# EAGLE design untitled (EAGLE 9.6.2)
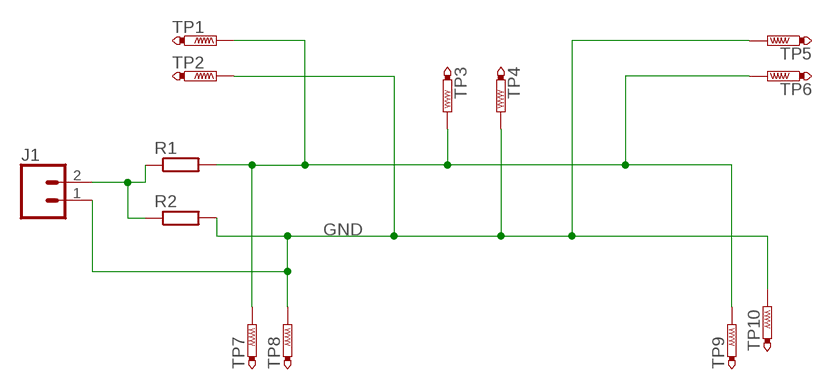
[diagram p0: schematic, sheet 1]

## Parts
J1  CONN_02LOCK_LONGPADS  [1X02_LOCK_LONGPADS]
R1  R-EU_0207/12  [0207/12]
R2  R-EU_0207/12  [0207/12]
TP1  PTR1TP20R  [TP20R]
TP2  PTR1TP20R  [TP20R]
TP3  PTR1TP20R  [TP20R]
TP4  PTR1TP20R  [TP20R]
TP5  PTR1TP20R  [TP20R]
TP6  PTR1TP20R  [TP20R]
TP7  PTR1TP20R  [TP20R]
TP8  PTR1TP20R  [TP20R]
TP9  PTR1TP20R  [TP20R]
TP10  PTR1TP20R  [TP20R]

## Nets
GND: J1.1 R2.2 TP2.TP TP4.TP TP5.TP TP8.TP TP10.TP
N$1: J1.2 R1.1 R2.1
VCC: R1.2 TP1.TP TP3.TP TP6.TP TP7.TP TP9.TP

## Library data of the parts
J1 = SparkFun-Connectors:CONN_02: Multi connection point. Often used as Generic Header-pin footprint for 0.1 inch spaced/style header connections On any of the 0.1 inch spaced packages, you can populate with these: Break Away Headers - Straight <https://www.sparkfun.com/products/116> (PRT-00116) Break Away Male Headers - Right Angle <https://www.sparkfun.com/products/553> (PRT-00553) Female Headers <https://www.sparkfun.com/products/115> (PRT-00115) Break Away Headers - Machine Pin <https://www.sparkfun.com/products/117> (PRT-00117) Break Away Female Headers - Swiss Machine Pin <https://www.sparkfun.com/products/743> (PRT-00743) For SCREWTERMINALS and SPRING TERMINALS visit here: Screw Terimnals on SparkFun.com <https://www.sparkfun.com/search/results?term=Screw+Terminals> (5mm/3.5mm/2.54mm spacing) This device is also useful as a general connection point to wire up your design to another part of your project. Our various solder wires solder well into these plated through hole pads. Hook-Up Wire - Assortment (Stranded, 22 AWG) <https://www.sparkfun.com/products/11375> (PRT-11375) Hook-Up Wire - Assortment (Solid Core, 22 AWG) <https://www.sparkfun.com/products/11367> (PRT-11367) View the entire wire category on our website here <https://www.sparkfun.com/categories/141> Special notes: Molex polarized connector foot print use with: PRT-08233 with associated crimp pins and housings. 2.54_SCREWTERM for use with PRT-10571. 3.5mm Screw Terminal footprints for PRT-08084 5mm Screw Terminal footprints for use with PRT-08432
R1 R2 = rcl:R-EU_: RESISTOR, European symbol; SPICEPREFIX: R
TP1-TP10 = testpad:PTR1: TEST PIN

## Board
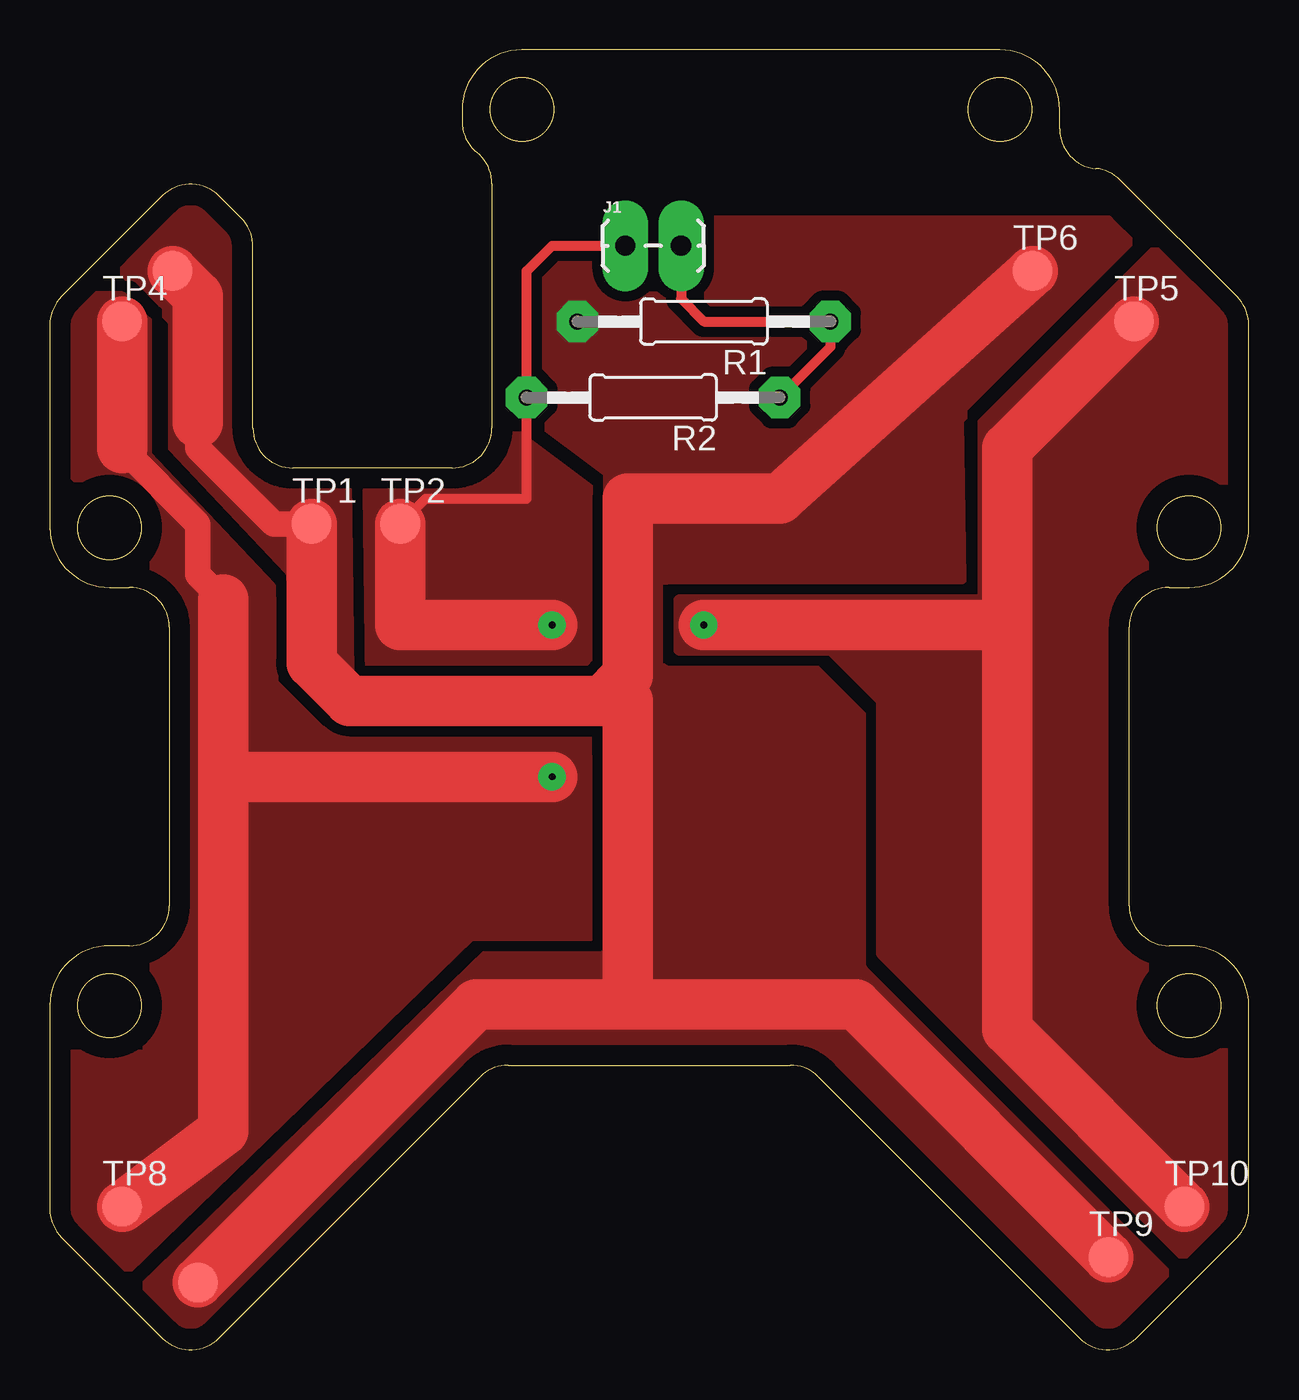
[diagram p1: board, top side]
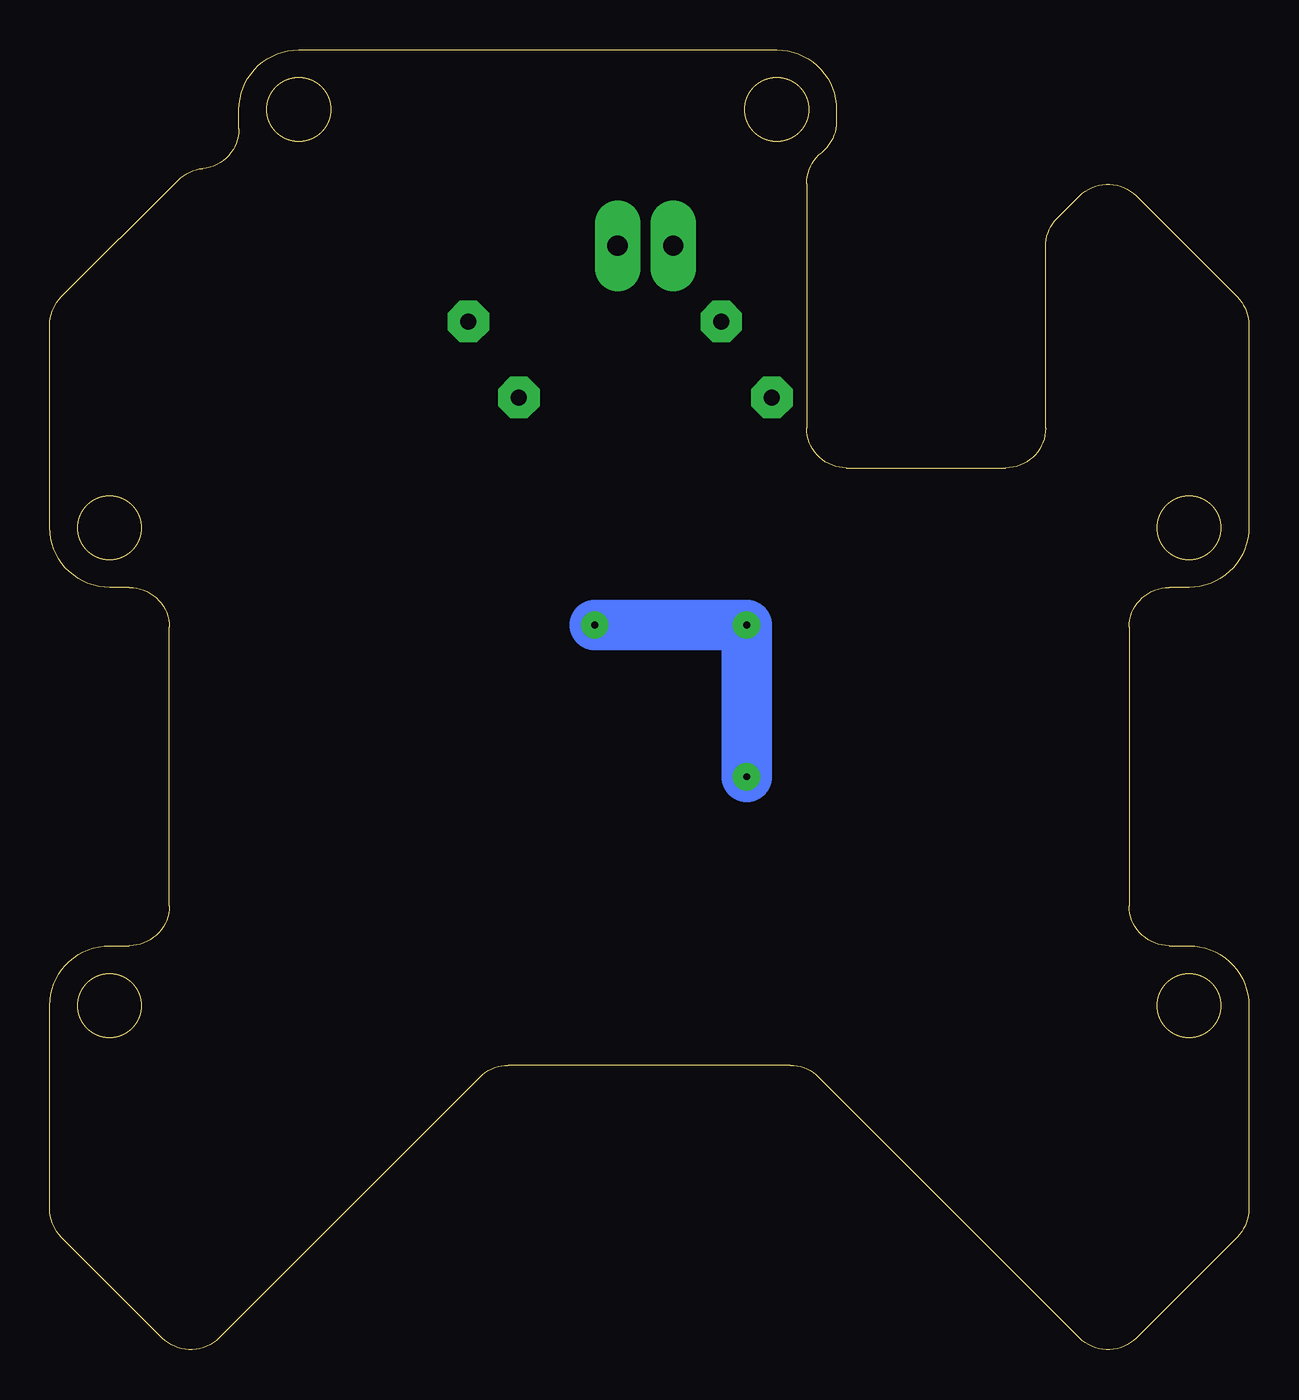
[diagram p2: board, bottom side, seen from below]

Size 60.2 x 65.29 mm. Coordinates in mm from the lower left corner, seen from the top.
Outline: 10.2,46.29 arc90 12.2,44.29 20.2,44.29 arc90 22.2,46.29 22.2,58.57 arc51 21.45,60.13 arc-51 20.7,61.69 20.7,62.29 arc-90 23.7,65.29 47.7,65.29 arc-90 50.7,62.29 50.7,61.32 arc85 52.51,59.33 arc-40 53.74,58.75 59.61,52.88 arc-45 60.2,51.47 60.2,41.29 arc-90 57.2,38.29 56.2,38.29 arc90 54.2,36.29 54.2,22.29 arc90 56.2,20.29 57.2,20.29 arc-90 60.2,17.29 60.2,7.07 arc-45 59.61,5.65 54.54,0.58 arc-90 51.71,0.58 38.59,13.71 arc45 37.18,14.29 23.02,14.29 arc45 21.61,13.71 8.49,0.58 arc-90 5.66,0.58 0.59,5.65 arc-45 0,7.07 0,17.29 arc-90 3,20.29 4,20.29 arc90 6,22.29 6,36.29 arc90 4,38.29 3,38.29 arc-90 0,41.29 0,51.47 arc-45 0.59,52.88 5.66,57.95 arc-90 8.49,57.95 9.61,56.83 arc-45 10.2,55.41 10.2,46.29
Outline: circle at 23.7,62.29 radius 1.6
Outline: circle at 57.2,17.29 radius 1.6
Outline: circle at 3,17.29 radius 1.6
Outline: circle at 3,41.29 radius 1.6
Outline: circle at 57.2,41.29 radius 1.6
Outline: circle at 47.7,62.29 radius 1.6
Copper layers (1*16): Top 0.035mm / dielectric 1.5mm / Bottom 0.035mm
Design rules "default *": minimum track width 6mil, minimum drill 0.9mm, track to track 12mil, track to pad 12mil, pad to pad 12mil, via to via 12mil, smd to smd 12mil, copper to edge 40mil, drill to drill 6mil, minimum pad ring 25mil, minimum via ring 20mil, stop-mask expansion 4mil, vias tented up to drill 0mil, thermal gap 10mil

### Footprints (pad centres in the part's own frame; a part is rotated, then mirrored left to right if it is on the bottom)
1X02_LOCK_LONGPADS = drill 1.016 long: 1 -0.127,0; 2 2.667,0
0207/12 = drill 0.813 octagon: 1 -6.35,0; 2 6.35,0
TP20R = smd 2 x 2: TP 0,0

### Placement (x,y rotation side)
J1  29.03,55.45 0 top
R1  32.84,51.64 180 top
R2  30.3,47.83 180 top
TP1  13.15,41.48 0 top
TP2  17.6,41.48 0 top
TP3  6.17,54.18 0 top
TP4  3.63,51.64 0 top
TP5  54.43,51.64 0 top
TP6  49.35,54.18 0 top
TP7  7.44,3.38 0 top
TP8  3.63,7.19 0 top
TP9  53.16,4.65 0 top
TP10  56.97,7.19 0 top

### Tracks (layer width: path | path; a pad name or v marks a point on that pad's centre or on a via)
GND  (via drill 0.35)
  Top 0.508: TP2.TP 18.87,42.75 23.95,42.75 R2.2 23.95,54.18 25.22,55.45 J1.1
  Top 1.27: 3.63,45.29 7.44,41.48 7.44,38.94 8.71,37.67
  Top 2.54: TP4.TP 3.63,45.29 | TP8.TP 8.71,11 8.71,28.78 | 8.71,28.78 8.71,37.67 | TP10.TP 48.08,16.08 48.08,36.4 | TP2.TP 17.6,36.4 v25.22,36.4 | TP5.TP 48.08,45.29 48.08,36.4 | v32.84,36.4 48.08,36.4 | v25.22,28.78 8.71,28.78
  Bottom 2.54: v32.84,36.4 v25.22,36.4 v25.22,28.78
  pour Top (isolate 0.508, no thermals): 0.83,6.55 2.99,3.13 21.15,20.78 27.12,20.78 26.99,30.88 13.63,31.09 11.25,33.48 11.12,38.3 4.9,44.91 4.9,51.64 3.63,52.91 1.09,52.91 -0.18,51.64 -0.18,45.29 4.9,40.21 4.9,14.81 1.09,14.81
  pour Top (isolate 0.508): 56.97,4.65 59.51,7.19 59.51,18.62 58.24,19.89 54.43,21.16 54.43,36.4 58.24,38.94 59.51,40.21 59.51,51.64 55.7,55.45 46.81,46.56 46.81,37.67 31.57,37.67 31.57,35.13 39.19,35.13 41.73,32.59 41.73,19.89
  pour Top (isolate 0.508): 15.95,43.13 16.07,33.61 27.63,33.61 27.76,42.75 22.68,46.56 18.87,46.56
N$1
  Top 0.508: J1.2 31.69,52.78 32.84,51.64 R1.1 39.19,50.37 R2.1
VCC
  Top 1.27: TP1.TP 11.25,41.48 7.44,45.29 7.44,46.56
  Top 2.54: TP3.TP 7.44,52.91 7.44,46.56 | TP6.TP 36.65,42.75 29.03,42.75 29.03,33.86 27.76,32.59 | TP1.TP 13.15,34.49 15.06,32.59 27.76,32.59 | 27.76,32.59 29.03,32.59 29.03,17.35 | TP7.TP 21.41,17.35 29.03,17.35 | 29.03,17.35 40.46,17.35 TP9.TP
  pour Top (isolate 0.508, rank 3, no thermals): 3.63,54.18 6.17,51.64 6.17,45.04 12.39,38.43 12.52,33.86 13.79,32.59 28.01,32.46 28.01,19.89 20.14,19.89 2.36,2.11 7.44,-0.43 22.68,14.81 37.92,14.81 54.43,-1.7 58.24,3.38 41.73,19.89 41.73,31.32 38.81,34.11 30.55,34.24 30.55,38.69 45.79,38.69 45.66,46.69 54.43,55.45 53.16,56.72 22.68,56.72 22.68,47.83 26.49,44.02 26.49,33.86 15.06,33.86 14.93,43.77 11.12,43.89 9.98,45.29 9.98,56.72 7.44,59.26 3.63,55.45